# Altium schematic sheet Sheet_1_2020-07-31_21-30-49.schdoc
size 191 x 276 mm
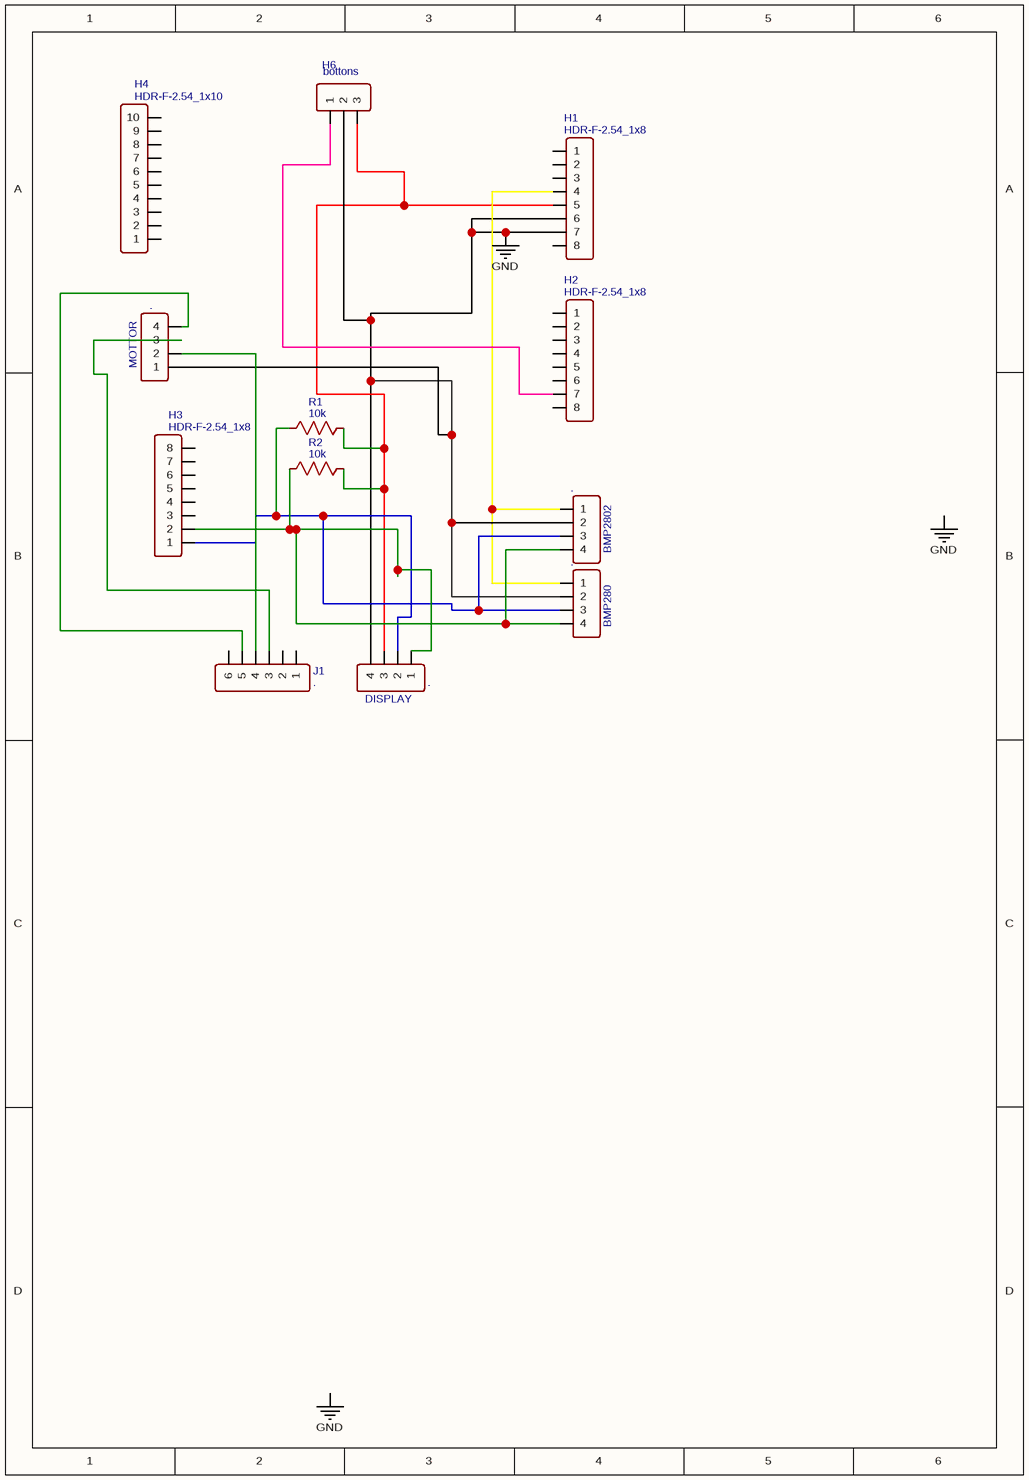
[diagram p0: Sheet_1_2020-07-31_21-30-49.schdoc]

## Parts
BMP280  .  [HDR-F-2.54_1X4]
BMP2802  .  [HDR-F-2.54_1X4]
DISPLAY  .  [HDR-F-2.54_1X4]
H1  HDR-F-2.54_1x8  [HDR-F-2.54_1X8]
H2  HDR-F-2.54_1x8  [HDR-F-2.54_1X8]
H3  HDR-F-2.54_1x8  [HDR-F-2.54_1X8]
H4  HDR-F-2.54_1x10  [HDR-F-2.54_1X10]
H6  bottons  [HDR-F-2.54_1X3]
J1  .  [HDR-F-2.54_1X6]
MOTTOR  .  [HDR-F-2.54_1X4]
R1  10k  [R_AXIAL-0.3]
R2  10k  [R_AXIAL-0.3]

## Nets
GND: BMP280.2 BMP2802.2 DISPLAY.4 H1.6 H1.7 H6.2 MOTTOR.1
NetBMP280_1: BMP280.1 BMP2802.1 H1.4
NetBMP280_3: BMP280.3 BMP280.4 BMP2802.3 BMP2802.4 DISPLAY.1 DISPLAY.2 H3.1 H3.2 J1.4 MOTTOR.2 R1.1 R2.1
NetDISPLAY_3: DISPLAY.3 H1.5 H6.3 R1.2 R2.2
NetH2_7: H2.7 H6.1
NetJ1_3: J1.3 MOTTOR.3
NetJ1_5: J1.5 MOTTOR.4

Not connected (* = marked no-connect by the designer): H1 1 2 3 8; H2 1 2 3 4 5 6 8; H3 3 4 5 6 7 8; H4 1 2 3 4 5 6 7 8 9 10; J1 1 2 6

## Notes on the sheet
- Labels drawn without touching a wire or pin: GND

## Library data of the parts
BMP280 BMP2802 DISPLAY J1 MOTTOR = .: Contributor: LCEDA_Lib; BOM_Supplier: LCSC
  BMP280 BMP2802 DISPLAY MOTTOR: BOM_Supplier Part: C225501; spicePre: H; spiceSymbolName: HDR-F-2.54_1x4
  J1: BOM_Supplier Part: C40877; spicePre: J; spiceSymbolName: HDR-F-2.54_1x6
H1-H3 = HDR-F-2.54_1x8: Contributor: LCEDA_Lib; BOM_Supplier Part: C225505; BOM_Supplier: LCSC; spicePre: H; spiceSymbolName: HDR-F-2.54_1x8
H4 = HDR-F-2.54_1x10: Contributor: LCEDA_Lib; BOM_Supplier Part: C35445; BOM_Supplier: LCSC; spicePre: H; spiceSymbolName: HDR-F-2.54_1x10
H6 = bottons: Contributor: LCEDA_Lib; BOM_Supplier Part: C146690; BOM_Supplier: LCSC; spicePre: H; spiceSymbolName: HDR-F-2.54_1x3
R1 R2 = 10k: nameAlias: Value(Ω); Contributor: LCEDA_Lib; spicePre: R; spiceSymbolName: R_AXIAL-0.3_US